# Altium schematic sheet I2C_board_Schematic.SchDoc
size 209 x 148 mm; SheetNumber: 1; SheetTotal: 1
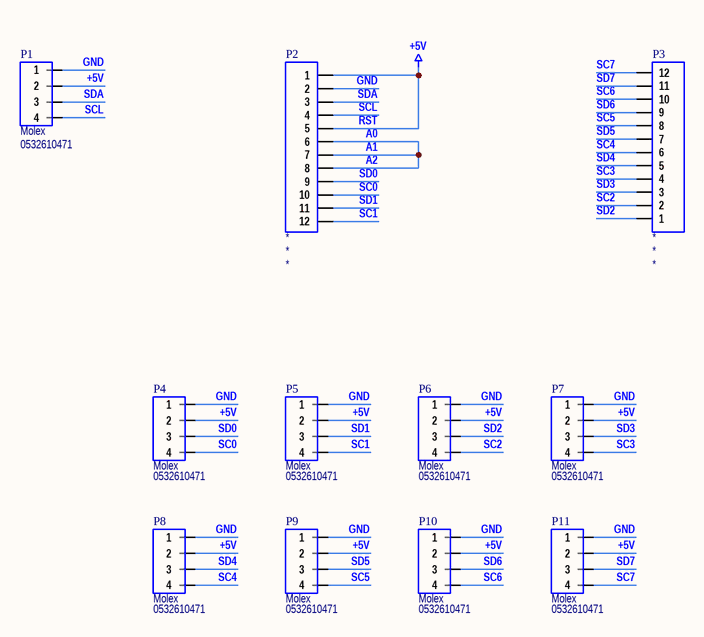
[diagram p0: I2C_board_Schematic.SchDoc]

## Parts
P1  Manufacturer: Molex  Model: 0532610471  [CONN MOLEX 53261-0471 (father)]  (hidden comment: CONN MOLEX 53261-0471 (father))
P2  Connector 1x12 0.1"  [CONN-12 1x12 MALE]  (value not drawn)
P3  Connector 1x12 0.1"  [CONN-12 1x12 MALE]  (value not drawn)
P4  Manufacturer: Molex  Model: 0532610471  [CONN MOLEX 53261-0471 (father)]  (hidden comment: CONN MOLEX 53261-0471 (father))
P5  Manufacturer: Molex  Model: 0532610471  [CONN MOLEX 53261-0471 (father)]  (hidden comment: CONN MOLEX 53261-0471 (father))
P6  Manufacturer: Molex  Model: 0532610471  [CONN MOLEX 53261-0471 (father)]  (hidden comment: CONN MOLEX 53261-0471 (father))
P7  Manufacturer: Molex  Model: 0532610471  [CONN MOLEX 53261-0471 (father)]  (hidden comment: CONN MOLEX 53261-0471 (father))
P8  Manufacturer: Molex  Model: 0532610471  [CONN MOLEX 53261-0471 (father)]  (hidden comment: CONN MOLEX 53261-0471 (father))
P9  Manufacturer: Molex  Model: 0532610471  [CONN MOLEX 53261-0471 (father)]  (hidden comment: CONN MOLEX 53261-0471 (father))
P10  Manufacturer: Molex  Model: 0532610471  [CONN MOLEX 53261-0471 (father)]  (hidden comment: CONN MOLEX 53261-0471 (father))
P11  Manufacturer: Molex  Model: 0532610471  [CONN MOLEX 53261-0471 (father)]  (hidden comment: CONN MOLEX 53261-0471 (father))

## Nets
+5V: P1.2 P2.1 P2.5 P4.2 P5.2 P6.2 P7.2 P8.2 P9.2 P10.2 P11.2  [also labelled RST]
A0: P2.6 P2.7 P2.8  [also labelled A1, A2]
GND: P1.1 P2.2 P4.1 P5.1 P6.1 P7.1 P8.1 P9.1 P10.1 P11.1
SC0: P2.10 P4.4
SC1: P2.12 P5.4
SC2: P3.2 P6.4
SC3: P3.4 P7.4
SC4: P3.6 P8.4
SC5: P3.8 P9.4
SC6: P3.10 P10.4
SC7: P3.12 P11.4
SCL: P1.4 P2.4
SD0: P2.9 P4.3
SD1: P2.11 P5.3
SD2: P3.1 P6.3
SD3: P3.3 P7.3
SD4: P3.5 P8.3
SD5: P3.7 P9.3
SD6: P3.9 P10.3
SD7: P3.11 P11.3
SDA: P1.3 P2.3

## Library data of the parts
P1 P4-P11 = CONN MOLEX 53261-0471 (father): Value: CONN HEADER SMD R/A 4POS 1.25MM; HelpURL: https://www.digikey.com/en/products/detail/molex/0532610471/699096?s=N4IgTCBcDaIKwGYwDYCMBaADAFgOypAF0BfIA; Case: Right Angle 4 position 0.049" (1.25mm)
P2 P3 = Connector 1x12 0.1": Manufacturer: *; HelpURL: *; Case: *; Value: *; Model: *